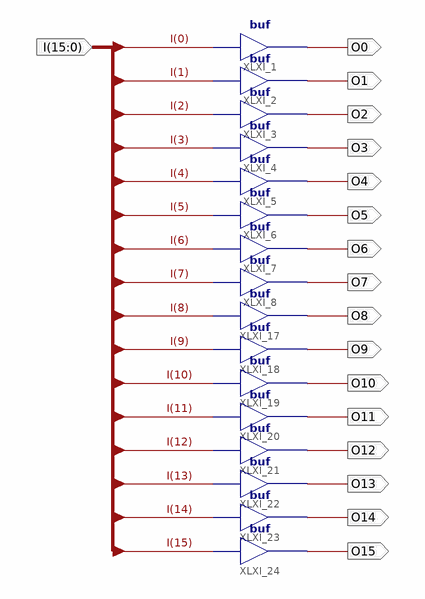
[diagram p0: schematic sheet 1]
// Xilinx ISE schematic btw16.sch (spartan6) as structural Verilog: 16 symbols, 17 ports
module btw16 (
  input  [15:0] I,
  output O0,
  output O1,
  output O2,
  output O3,
  output O4,
  output O5,
  output O6,
  output O7,
  output O8,
  output O9,
  output O10,
  output O11,
  output O12,
  output O13,
  output O14,
  output O15
);

  buf XLXI_1 (O0, I[0]);
  buf XLXI_2 (O1, I[1]);
  buf XLXI_3 (O2, I[2]);
  buf XLXI_4 (O3, I[3]);
  buf XLXI_5 (O4, I[4]);
  buf XLXI_6 (O5, I[5]);
  buf XLXI_7 (O6, I[6]);
  buf XLXI_8 (O7, I[7]);
  buf XLXI_17 (O8, I[8]);
  buf XLXI_18 (O9, I[9]);
  buf XLXI_19 (O10, I[10]);
  buf XLXI_20 (O11, I[11]);
  buf XLXI_21 (O12, I[12]);
  buf XLXI_22 (O13, I[13]);
  buf XLXI_23 (O14, I[14]);
  buf XLXI_24 (O15, I[15]);
endmodule
